# Altium schematic sheet HV_amplifier.SchDoc
size 420 x 297 mm; SheetNumber: 2; SheetTotal: 6
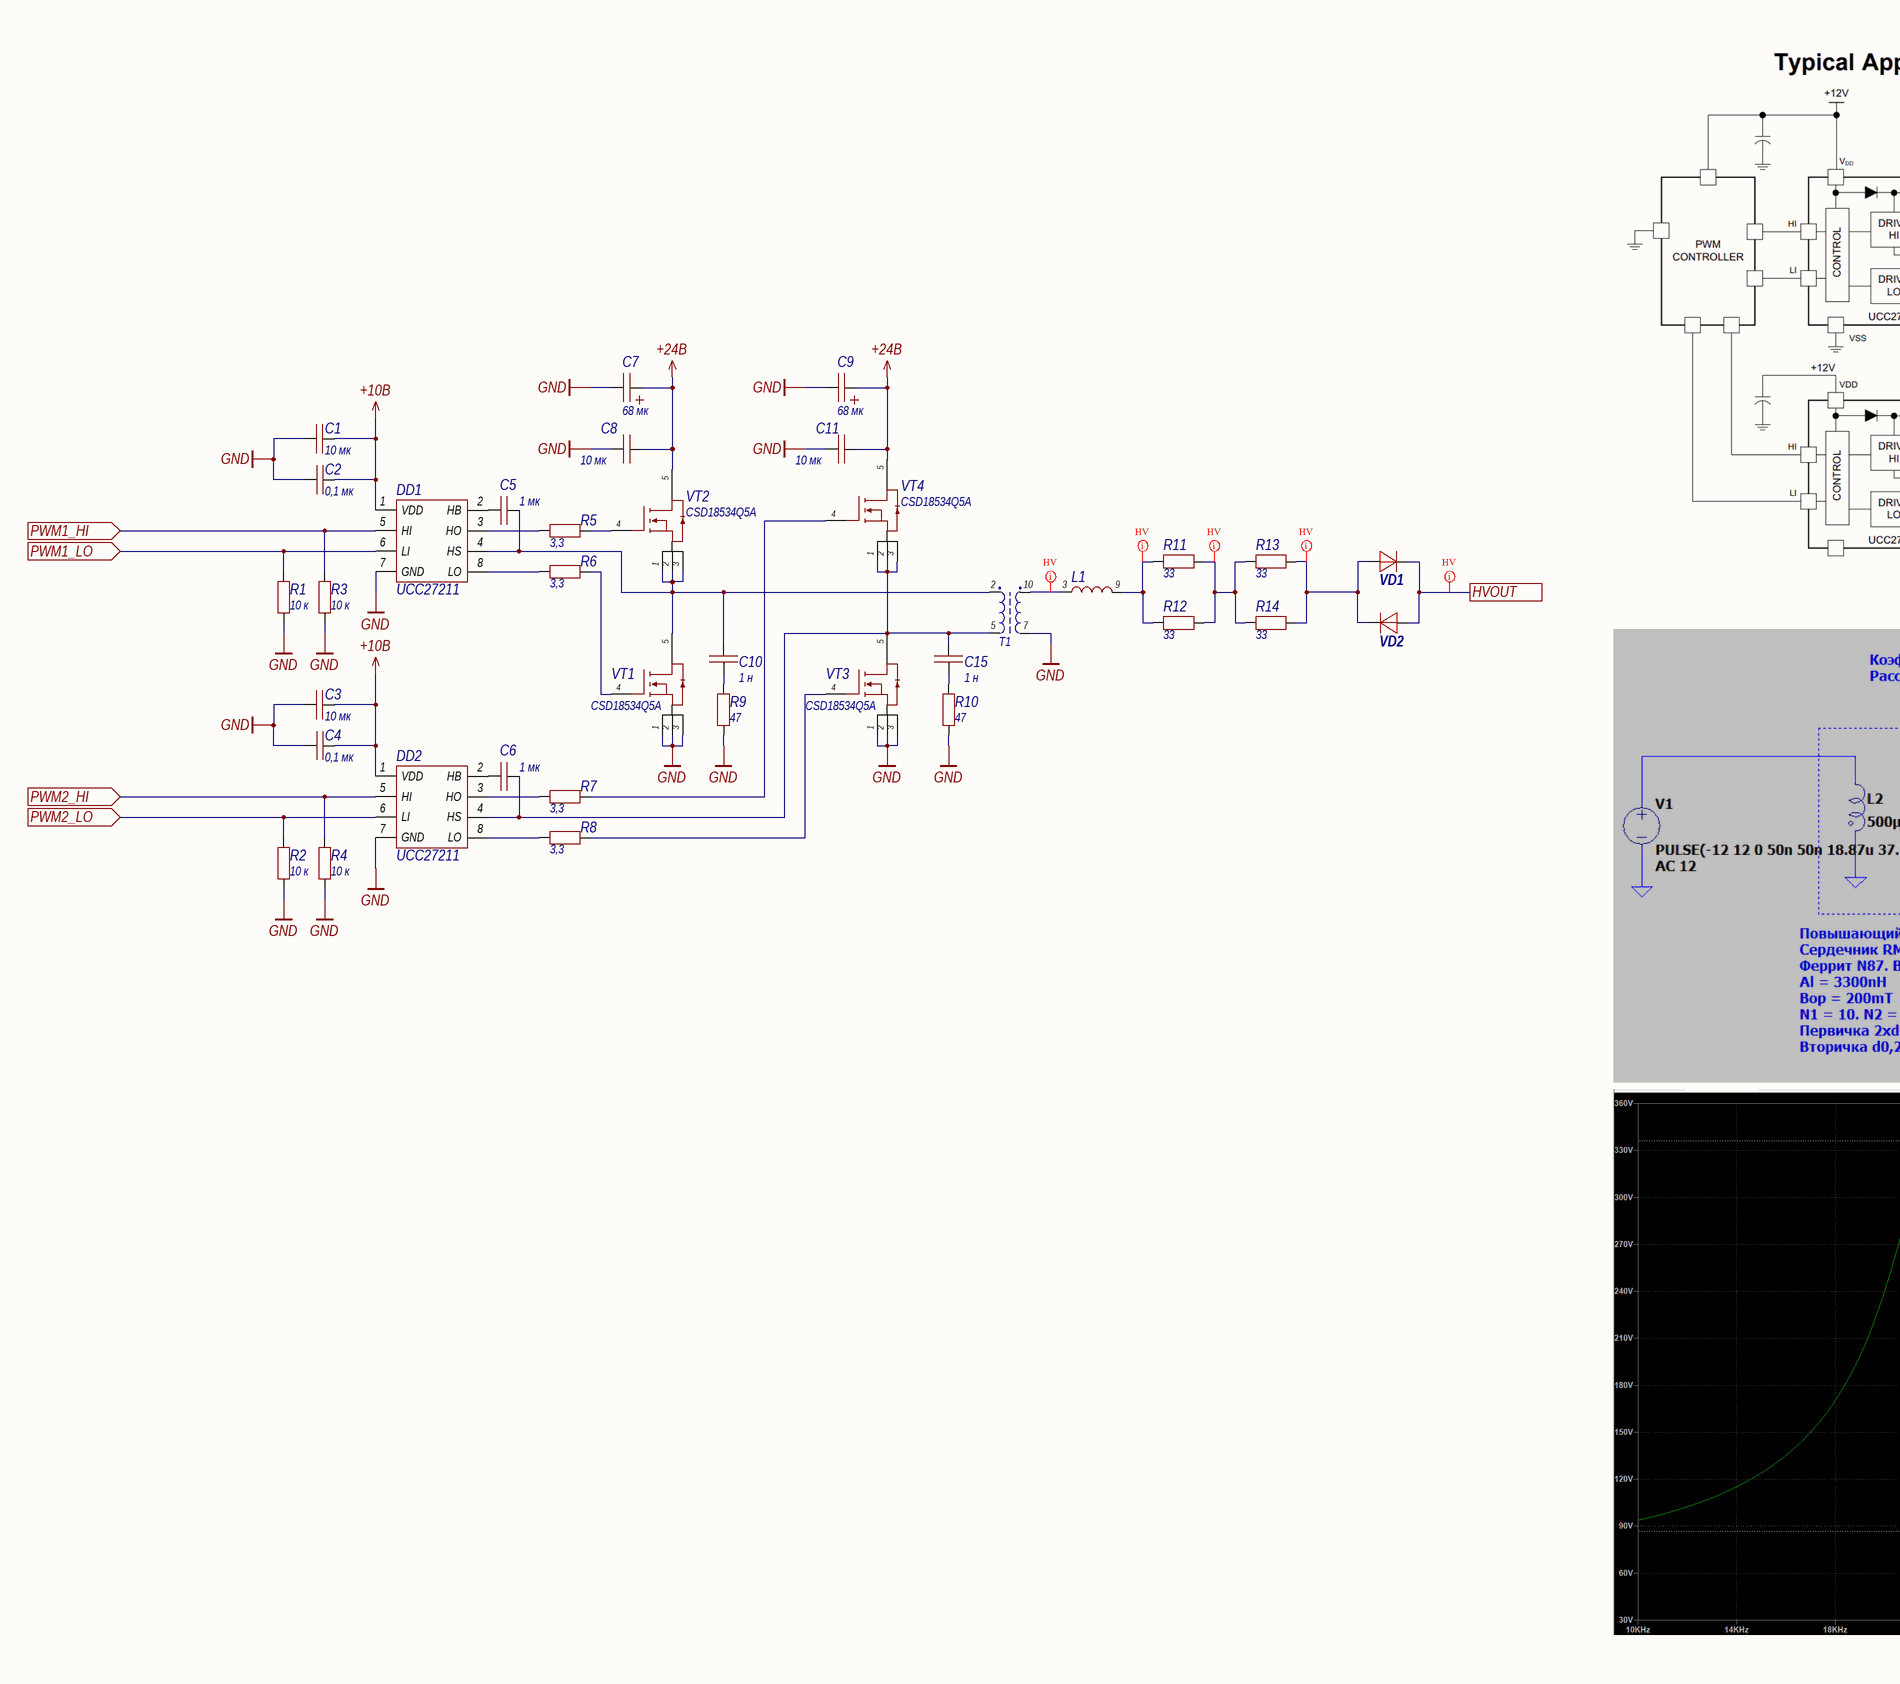
[diagram p0: HV_amplifier.SchDoc, left]
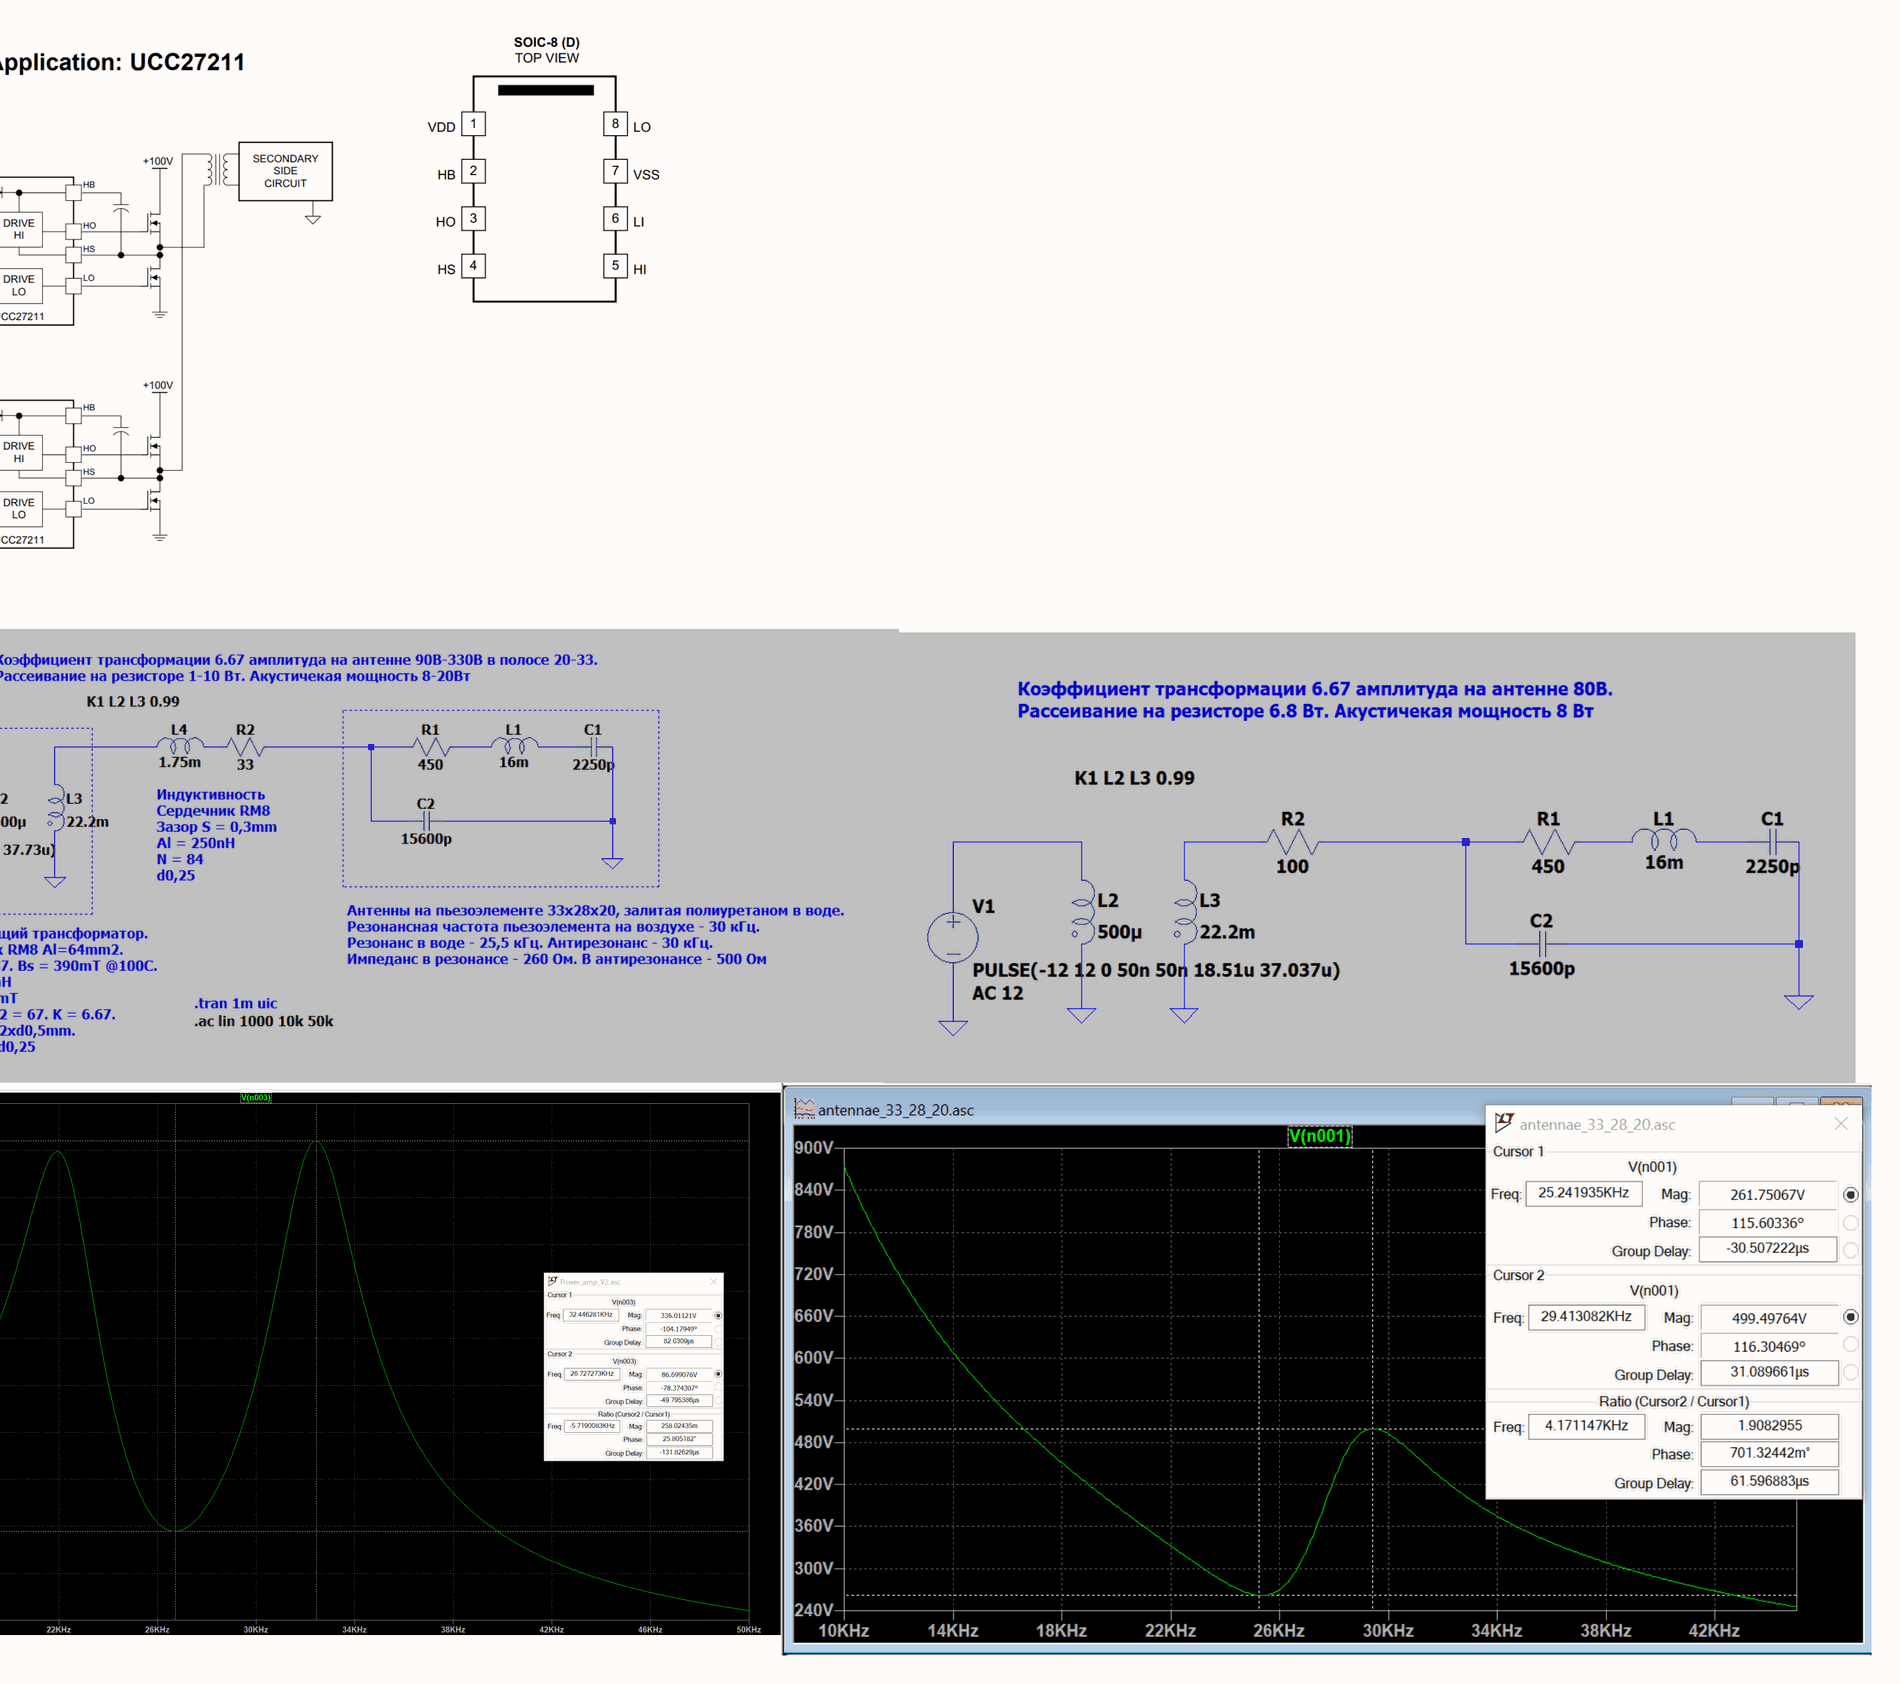
[diagram p1: HV_amplifier.SchDoc, right]

## Parts
C1  value 10 мк  [1210C]  (hidden comment: Capacitor)
C2  value 0,1 мк  [0603C]  (hidden comment: Capacitor)
C3  value 10 мк  [1210C]  (hidden comment: Capacitor)
C4  value 0,1 мк  [0603C]  (hidden comment: Capacitor)
C5  value 1 мк  [0603C]  (hidden comment: Capacitor)
C6  value 1 мк  [0603C]  (hidden comment: Capacitor)
C7  value 68 мк  [CAP_SMD_10x12,7]  (hidden comment: Capacitor)
C8  value 10 мк  [1210C]  (hidden comment: Capacitor)
C9  value 68 мк  [CAP_SMD_10x12,7]  (hidden comment: Capacitor)
C10  value 1 н  [0603C]  (hidden comment: Capacitor)
C11  value 10 мк  [1210C]  (hidden comment: Capacitor)
C15  value 1 н  [0603C]  (hidden comment: Capacitor)
DD1  UCC27211  [SOIC-8]
DD2  UCC27211  [SOIC-8]
L1  Inductance_RM8  [RM8_trans]  (value not drawn)
R1  value 10 к  [0603R]  (hidden comment: Resistor)
R2  value 10 к  [0603R]  (hidden comment: Resistor)
R3  value 10 к  [0603R]  (hidden comment: Resistor)
R4  value 10 к  [0603R]  (hidden comment: Resistor)
R5  value 3,3  [0603R]  (hidden comment: Resistor)
R6  value 3,3  [0603R]  (hidden comment: Resistor)
R7  value 3,3  [0603R]  (hidden comment: Resistor)
R8  value 3,3  [0603R]  (hidden comment: Resistor)
R9  value 47  [0805R]  (hidden comment: Resistor)
R10  value 47  [0805R]  (hidden comment: Resistor)
R11  value 33  [2512R]  (hidden comment: Resistor)
R12  value 33  [2512R]  (hidden comment: Resistor)
R13  value 33  [2512R]  (hidden comment: Resistor)
R14  value 33  [2512R]  (hidden comment: Resistor)
T1  Transformer_RM8  [RM8_trans]  (value not drawn)
VD1  SMA4007  [SMA]  (value not drawn)
VD2  SMA4007  [SMA]  (value not drawn)
VT1  CSD18534Q5A  [SON-8_5x6]
VT2  CSD18534Q5A  [SON-8_5x6]
VT3  CSD18534Q5A  [SON-8_5x6]
VT4  CSD18534Q5A  [SON-8_5x6]

## Ports
HVOUT, PWM1_HI (in), PWM1_LO (in), PWM2_HI (in), PWM2_LO (in)

## Nets
+10В: C1.1 C2.2 C3.1 C4.2 DD1.1(VDD) DD2.1(VDD)
+24В: C7.1 C8.2 C9.1 C11.2 VT2.5 VT4.5
GND: C1.2 C2.1 C3.2 C4.1 C7.2 C8.1 C9.2 C11.1 DD1.7(GND) DD2.7(GND) R1.1 R2.1 R3.1 R4.1 R9.1 R10.1 T1.7 VT1.1 VT1.2 VT1.3 VT3.1 VT3.2 VT3.3
HVOUT: VD1.2 VD2.1 ; port HVOUT
PWM1_HI: DD1.5(HI) R3.2 ; port PWM1_HI
PWM1_LO: DD1.6(LI) R1.2 ; port PWM1_LO
PWM2_HI: DD2.5(HI) R4.2 ; port PWM2_HI
PWM2_LO: DD2.6(LI) R2.2 ; port PWM2_LO
NetC5_1: C5.1 DD1.2(HB)
NetC5_2: C5.2 C10.2 DD1.4(HS) T1.2 VT1.5 VT2.1 VT2.2 VT2.3
NetC6_1: C6.1 DD2.2(HB)
NetC6_2: C6.2 C15.2 DD2.4(HS) T1.5 VT3.5 VT4.1 VT4.2 VT4.3
NetC10_1: C10.1 R9.2
NetC15_1: C15.1 R10.2
NetDD1_3: DD1.3(HO) R5.1
NetDD1_8: DD1.8(LO) R6.1
NetDD2_3: DD2.3(HO) R7.1
NetDD2_8: DD2.8(LO) R8.1
NetL1_3: L1.3 T1.10
NetL1_9: L1.9 R11.1 R12.1
NetR5_2: R5.2 VT2.4
NetR6_2: R6.2 VT1.4
NetR7_2: R7.2 VT4.4
NetR8_2: R8.2 VT3.4
NetR11_2: R11.2 R12.2 R13.1 R14.1
NetR13_2: R13.2 R14.2 VD1.1 VD2.2

## Layout directives
net class HV; rule Clearance Constraint [Clearance = 1mm]: HVOUT, NetL1_3, NetL1_9, NetR11_2, NetR13_2

## Notes on the sheet
- Перв. примен.
- Справ. №
- Подп. и дата
- Инв. № дубл.
- Взам. инв. №
- Инв. № подл.
- Изм.
- Лист
- № докум.
- Подп.
- Дата
- Копировал
- Формат А3

## Library data of the parts
C1 C3 C8 C11 = Capacitor_10u_10_35V_X7R_1210C: Конденсатор 1210C ёмкостью 10 мк 10%, 35 В, X7R; Voltage (V): 35; Capacity (nF): 10000; Part Number: Capacitor_10u_10_35V_X7R_1210C; Tolerance: 10%; Dielectric: X7R
C2 C4 = Capacitor_0,1u_10_50V_X7R_0603C: Конденсатор 0603C ёмкостью 0,1 мк 10%, 50 В, X7R; Voltage (V): 50; Capacity (nF): 100; Part Number: Capacitor_0,1u_10_50V_X7R_0603C; Tolerance: 10%; Dielectric: X7R
C5 C6 = Capacitor_1u_10_25V_X7R_0603C: Конденсатор 0603C ёмкостью 1 мк 10%, 25 В, X7R; Voltage (V): 25; Capacity (nF): 1000; Part Number: Capacitor_1u_10_25V_X7R_0603C; Tolerance: 10%; Dielectric: X7R
C7 C9 = 50SVPF68M: Конденсатор алюминиевый полимерный 68мкФ 50В ±20% (10х12.6мм) для поверхностного монтажа 0.02Ом 4300мА 5000час 105°С; Tolerance: 20; Voltage (V): 50; Type: SMD Aluminum; Capacity (uF): 68; Автор: glebmih; Datasheet: http://cdn.promelec.ru/upload/items/2022/11/10/SVPF-Series_.pdf; Part Number: 50SVPF68M
C10 C15 = Capacitor_1n_5_50V_NP0_0603C: Конденсатор 0603C ёмкостью 1 н 5%, 50 В, NP0; Voltage (V): 50; Capacity (nF): 1; Автор: glebmih; Part Number: Capacitor_1n_5_50V_NP0_0603C; Tolerance: 5%; Dielectric: NP0
DD1 DD2 = UCC27211: Полумостовой драйвер затвора для mosfet транзисторов; Автор: glebmih; Part Number: UCC27211; Datasheet: https://static.chipdip.ru/lib/348/DOC032348430.pdf
L1 = Inductance_RM8: Индуктивность на сердечнике RM8; Автор: glebmih; Part Number: Inductance_RM8; Datasheet: https://static.chipdip.ru/lib/153/DOC004153919.pdf
R1-R4 = Resistor_10k_1_0603: Резистор номиналом 10 кОм 1%; Power: *; Part Number: Resistor_10k_1_0603; Tolerance: 1%
R5-R8 = Resistor_3.3_1_0603: Резистор номиналом 3,3 Ом 1%; Power: *; Part Number: Resistor_3.3_1_0603; Tolerance: 1%
R9 R10 = Resistor_47_1_0805: Резистор номиналом 47 Ом 1%; Автор: glebmih; Power: *; Part Number: Resistor_47_1_0805; Tolerance: 1%
R11-R14 = Resistor_33_1_2512: Резистор номиналом 33 Ом 1%; Автор: glebmih; Power: *; Part Number: Resistor_33_1_2512; Tolerance: 1%
T1 = Transformer_RM8: Трансформатор на сердечнике RM8; Автор: glebmih; Part Number: Transformer_RM8; Datasheet: https://static.chipdip.ru/lib/153/DOC004153919.pdf
VD1 VD2 = SMA4007: Выпрямительный диод на 1000 В, ном. ток 1 А А; Voltage (V): 1000; Current: 1 А; Автор: glebmih; Part Number: SMA4007; Datasheet: https://static.chipdip.ru/lib/867/DOC050867185.pdf
VT1-VT4 = CSD18534Q5A: N-канальный MOSFET, 60 В, 50 А; Voltage (V): 60 В; Current (A): 50 А; Автор: glebmih; Part Number: CSD18534Q5A; Datasheet: https://static.chipdip.ru/lib/647/DOC053647214.pdf